# Altium schematic sheet Demo Board 2- Schematic.SchDoc
size A4; SheetNumber: 2; SheetTotal: 4
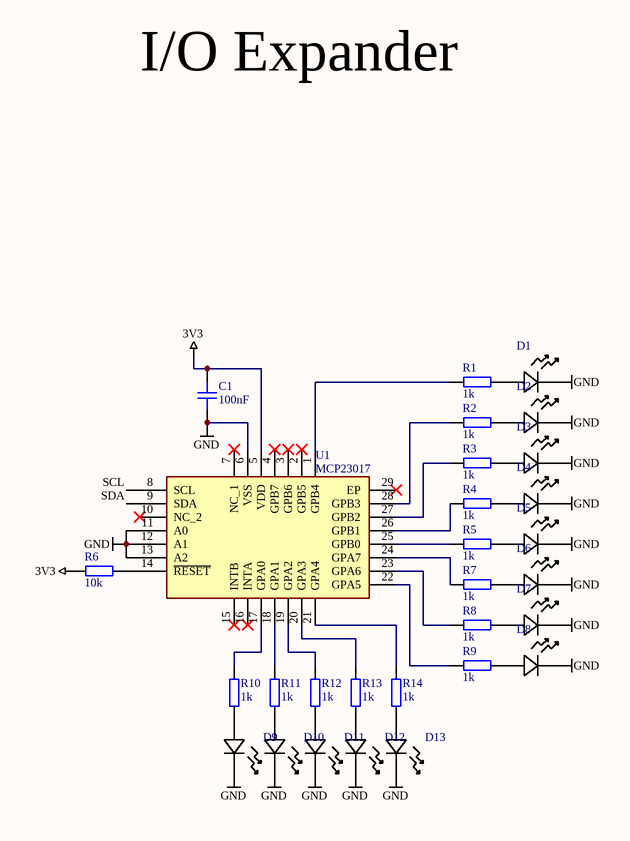
[diagram p0: Demo Board 2- Schematic.SchDoc]

## Parts
C1  100nF  [CAP_0603]
D1  SML-310VTT86  [LED_SML-310_ROM]  (value not drawn)
D2  SML-310VTT86  [LED_SML-310_ROM]  (value not drawn)
D3  SML-310VTT86  [LED_SML-310_ROM]  (value not drawn)
D4  SML-310VTT86  [LED_SML-310_ROM]  (value not drawn)
D5  SML-310VTT86  [LED_SML-310_ROM]  (value not drawn)
D6  SML-310VTT86  [LED_SML-310_ROM]  (value not drawn)
D7  SML-310VTT86  [LED_SML-310_ROM]  (value not drawn)
D8  SML-310VTT86  [LED_SML-310_ROM]  (value not drawn)
D9  SML-310VTT86  [LED_SML-310_ROM]  (value not drawn)
D10  SML-310VTT86  [LED_SML-310_ROM]  (value not drawn)
D11  SML-310VTT86  [LED_SML-310_ROM]  (value not drawn)
D12  SML-310VTT86  [LED_SML-310_ROM]  (value not drawn)
D13  SML-310VTT86  [LED_SML-310_ROM]  (value not drawn)
R1  1k  [RES_0603]
R2  1k  [RES_0603]
R3  1k  [RES_0603]
R4  1k  [RES_0603]
R5  1k  [RES_0603]
R6  10k  [RES_0603]
R7  1k  [RES_0603]
R8  1k  [RES_0603]
R9  1k  [RES_0603]
R10  1k  [RES_0603]
R11  1k  [RES_0603]
R12  1k  [RES_0603]
R13  1k  [RES_0603]
R14  1k  [RES_0603]
U1  MCP23017  [QFN65P600X600X100-29N-D]

## Nets
3V3: C1.2 R6.1 U1.5(VDD)
GND: C1.1 D1.1 D2.1 D3.1 D4.1 D5.1 D6.1 D7.1 D8.1 D9.1 D10.1 D11.1 D12.1 D13.1 U1.6(VSS) U1.11(A0) U1.12(A1) U1.13(A2)
SCL: U1.8(SCL)
SDA: U1.9(SDA)
NetD1_2: D1.2 R1.2
NetD2_2: D2.2 R2.2
NetD3_2: D3.2 R3.2
NetD4_2: D4.2 R4.2
NetD5_2: D5.2 R5.2
NetD6_2: D6.2 R7.2
NetD7_2: D7.2 R8.2
NetD8_2: D8.2 R9.2
NetD9_2: D9.2 R10.2
NetD10_2: D10.2 R11.2
NetD11_2: D11.2 R12.2
NetD12_2: D12.2 R13.2
NetD13_2: D13.2 R14.2
NetR1_1: R1.1 U1.1(GPB4)
NetR2_1: R2.1 U1.28(GPB3)
NetR3_1: R3.1 U1.27(GPB2)
NetR4_1: R4.1 U1.26(GPB1)
NetR5_1: R5.1 U1.25(GPB0)
NetR6_2: R6.2 U1.14(~{RESET})
NetR7_1: R7.1 U1.24(GPA7)
NetR8_1: R8.1 U1.23(GPA6)
NetR9_1: R9.1 U1.22(GPA5)
NetR10_1: R10.1 U1.17(GPA0)
NetR11_1: R11.1 U1.18(GPA1)
NetR12_1: R12.1 U1.19(GPA2)
NetR13_1: R13.1 U1.20(GPA3)
NetR14_1: R14.1 U1.21(GPA4)

Not connected (* = marked no-connect by the designer): U1 2(GPB5)* 3(GPB6)* 4(GPB7)* 7(NC_1)* 10(NC_2)* 15(INTB)* 16(INTA)* 29(EP)*

## Notes on the sheet
- I/O Expander

## Library data of the parts
C1 = CAP_0603: Capacitor SMD 0603; Manufacturer: *; Manufacturer Part Number: *; Distributor Link: *; LCSC: *; Rating: *; Dielectric: *
D1-D13 = SML-310VTT86: Description; Manufacturer_Name: ROHM Semiconductor; Copyright: Copyright (C) 2025 Ultra Librarian. All rights reserved.; Manufacturer_Part_Number: SML-310VTT86
R1-R14 = RES_0603: Resistor SMD 0603; Manufacturer: *; Manufacturer Part Number: *; Distributor Link: *; LCSC: *
U1 = MCP23017-E_ML: Integrated Circuit; Manufacturer_Name: Microchip; Manufacturer_Part_Number: MCP23017-E/ML; Datasheet Link: https://datasheet.datasheetarchive.com/originals/distributors/SFDatasheet-4/sf-00090057.pdf; Height: 1mm; Mouser Part Number: 579-MCP23017-E/ML; Mouser Price/Stock: https://www.mouser.co.uk/ProductDetail/Microchip-Technology/MCP23017-E-ML?qs=usxtMOJb1RwOdfCNDE63wQ%3D%3D; Arrow Part Number: MCP23017-E/ML; Arrow Price/Stock: https://www.arrow.com/en/products/mcp23017-eml/microchip-technology?utm_currency=USD&region=nac